# Altium project OpenHEGV3.PrjPcb
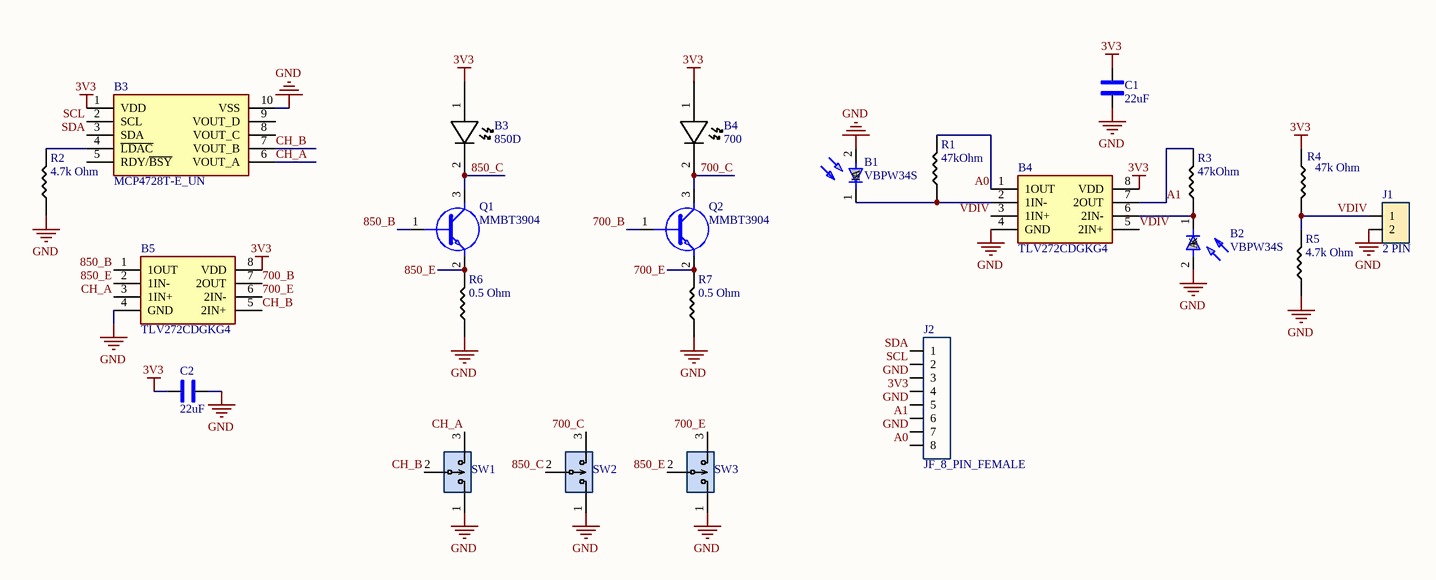
[diagram p0: OpenHEG.SchDoc]
1 sheet, 23 parts. Net scope: global (net labels, ports and power ports of the same name join across sheets).
Board file: OpenHEG.PcbDoc

## Sheet OpenHEG.SchDoc
size A3; SheetNumber: 1; SheetTotal: 1

### Parts
(Parts that share a designator on the sheet are numbered #1, #2 ... from top to bottom, then left to right.)
B1  VBPW34S  [VBPW34S]
B2  VBPW34S  [VBPW34S]
B3#1  MCP4728T-E_UN  [SOP50P490X110-10N]
B3#2  850D  [PCBComponent_1]
B4#1  700  [PCBComponent_1]
B4#2  TLV272CDGKG4  [SOP65P490X110-8N]
B5  TLV272CDGKG4  [SOP65P490X110-8N]
C1  22uF  [1206_Passive_Capacitor]
C2  22uF  [1206_Passive_Capacitor]
J1  2 PIN  [2_PIN_100MIL]
J2  JF_8_PIN_FEMALE  [8_PIN_100MIL - Female]
Q1  MMBT3904  [SOT95P240X120-3N]
Q2  MMBT3904  [SOT95P240X120-3N]
R1  value 47kOhm  [0603_PASSIVE_Resistor]  (hidden comment: 47k Ohm)
R2  4.7k Ohm  [0603_PASSIVE_Resistor]
R3  value 47kOhm  [0603_PASSIVE_Resistor]  (hidden comment: 47k Ohm)
R4  value 47k Ohm  [0603_PASSIVE_Resistor]  (hidden comment: 47kOhm)
R5  4.7k Ohm  [0603_PASSIVE_Resistor]
R6  0.5 Ohm  [0603_PASSIVE_Resistor]
R7  0.5 Ohm  [0603_PASSIVE_Resistor]
SW1  PREC003SAAN-RC  [3_PIN_100mil]  (value not drawn)
SW2  PREC003SAAN-RC  [3_PIN_100mil]  (value not drawn)
SW3  PREC003SAAN-RC  [3_PIN_100mil]  (value not drawn)

### Nets
3V3: B3#1.1(VDD) B3#2.1 B4#1.1 B4#2.8(VDD) B5.8(VDD) C1.1 C2.2 J2.4 R4.1
GND: B1.2(A) B2.2(A) B3#1.10(VSS) B4#2.4(GND) B5.4(GND) C1.2 C2.1 J1.2 J2.3 J2.5 J2.7 R2.1 R5.1 R6.1 R7.1 SW1.1 SW2.1 SW3.1
700_B: B5.7(2OUT) Q2.1(B)
700_C: B4#1.2 Q2.3(C) SW2.3
700_E: B5.6(2IN-) Q2.2(E) R7.2 SW3.3
850_B: B5.1(1OUT) Q1.1(B)
850_C: B3#2.2 Q1.3(C) SW2.2
850_E: B5.2(1IN-) Q1.2(E) R6.2 SW3.2
A0: B4#2.1(1OUT) J2.8 R1.2
A1: B4#2.7(2OUT) J2.6 R3.2
CH_A: B3#1.6(VOUT_A) B5.3(1IN+) SW1.3
CH_B: B3#1.7(VOUT_B) B5.5(2IN+) SW1.2
SCL: B3#1.2(SCL) J2.2
SDA: B3#1.3(SDA) J2.1
VDIV: B4#2.3(1IN+) B4#2.5(2IN+) J1.1 R4.2 R5.2
NetB1_1: B1.1(K) B4#2.2(1IN-) R1.1
NetB2_1: B2.1(K) B4#2.6(2IN-) R3.1
NetB3#1_4: B3#1.4(~{LDAC}) R2.2

Not connected (* = marked no-connect by the designer): B3#1 5(RDY/~{BSY}) 8(VOUT_C) 9(VOUT_D)

### Library data of the parts
B1 B2 = CMP-006-000002-2: Photodiode PIN Chip 940nm 2-Pin SMD T/R; Manufacturer_Name: Vishay; Geometry.Height: 1.4mm; Mouser Price/Stock: https://www.mouser.co.uk/ProductDetail/Vishay-Semiconductors/VBPW34S?qs=Uj7aA%252BCqp8ZDwjFKEZ8K8A%3D%3D; Source: VBPW34S.SchLib; Mouser Part Number: 782-VBPW34S; Arrow Part Number: VBPW34S; Manufacturer_Part_Number: VBPW34S; Design Item ID: VBPW34S; Datasheet Link: https://componentsearchengine.com/Datasheets/2/VBPW34S.pdf; Arrow Price/Stock: https://www.arrow.com/en/products/vbpw34s/vishay?utm_currency=USD&region=nac
B3#1 = CMP-009-000002-1: Digital to Analog Converters - DAC Quad 12-bit NV DAC with I2C interface; Manufacturer_Name: Microchip; Manufacturer_Part_Number: MCP4728T-E/UN; Geometry.Height: 1.1mm; Mouser Price/Stock: https://www.mouser.co.uk/ProductDetail/Microchip-Technology/MCP4728T-E-UN?qs=E6wAi2XWqcPJxULNRq0fKQ%3D%3D; Mouser Part Number: 579-MCP4728T-E/UN; Arrow Part Number: MCP4728T-E/UN; Arrow Price/Stock: https://www.arrow.com/en/products/mcp4728t-eun/microchip-technology?utm_currency=USD&region=nac; Design Item ID: MCP4728T-E_UN; Datasheet Link: https://componentsearchengine.com/Datasheets/2/MCP4728T-E_UN.pdf; Source: MCP4728T-E_UN.SchLib
B3#2 B4#1 = CMP-022-000000-1: Design Item ID: 805D; Source: SMT850.SchLib
B4#2 B5 = CMP-003-000001-2: Operational Amplifiers - Op Amps 550-uA/Ch 3-MHz Rail-to-Rail Out; Manufacturer_Name: Texas Instruments; Geometry.Height: 1.1mm; Mouser Part Number: 595-TLV272CDGKG4; Manufacturer_Part_Number: TLV272CDGKG4; Source: TLV272CDGKG4.SchLib; Arrow Part Number: *; Design Item ID: TLV272CDGKG4; Mouser Price/Stock: https://www.mouser.com/Search/Refine.aspx?Keyword=595-TLV272CDGKG4; Arrow Price/Stock: *; Datasheet Link: https://www.ti.com/lit/ds/symlink/tlv272.pdf?ts=1621864530946&ref_url=https%253A%252F%252Fwww.ti.com%252Fproduct%252FTLV272
C1 C2 = C_22uF_1206: 22uF ±10% 25V X5R 1206 Multilayer Ceramic Capacitors MLCC - SMD/SMT RoHS; MFR Part #: CL31A226KAHNNNE; Type: basic; LCSC Part#: C12891; Datasheet: https://datasheet.lcsc.com/lcsc/1811031514_Samsung-Electro-Mechanics-CL31A226KAHNNNE_C12891.pdf; Value: 22uF
J1 = JM_2_PIN_MALE: 2.54mm Straight 2 1 Header，Breakaway Through Hole,P=2.54mm Pin Header & Female Header ROHS; MFR Part #: B-2100S02P-A110; Type: Extended; Datasheet: https://datasheet.lcsc.com/lcsc/1811151421_Ckmtw-Shenzhen-Cankemeng-B-2100S02P-A110_C124375.pdf; LCSC Part#: C124375; Value: 2 PIN
J2 = CMP-005-000002-1: 8 Position Header Connector 0.100" (2.54mm) Through Hole Tin; MFR Part #: PPTC081LFBN-RC; Source: iotaCore.SCHLIB; LCSC Part#: C27438; Type: Extended; Pin Count: 8; Component Type: Standard; Digikey Link: https://www.digikey.com/product-detail/en/PPTC081LFBN-RC/S7006-ND/810147/?itemSeq=304982354; Design Item ID: JF_8_PIN_FEMALE
Q1 Q2 = CMP-017-000000-1: SOT-23-3; Manufacturer_Name: onsemi; Geometry.Height: 1.2mm; Source: MMBT3904.SchLib; Arrow Part Number: MMBT3904; Manufacturer_Part_Number: MMBT3904; Mouser Part Number: 512-MMBT3904; Arrow Price/Stock: https://www.arrow.com/en/products/mmbt3904/on-semiconductor; Datasheet Link: https://www.onsemi.com/download/data-sheet/pdf/PZT3904-D.pdf; Mouser Price/Stock: https://www.mouser.co.uk/ProductDetail/onsemi-Fairchild/MMBT3904?qs=UMEuL5FsraCg3xKjS4uBJQ%3D%3D; Design Item ID: MMBT3904
R1 R3 R4 = R_2Ohm_0603: CHIP RESISTOR - SURFACE MOUNT 47kOHMS ±1% 1/10W 0603 ROHS; MFR Part #: 0603WAF200KT5E; Datasheet: https://datasheet.lcsc.com/szlcsc/Uniroyal-Elec-0603WAF200KT5E_C22977.pdf; LCSC Part#: C22977; Type: Basic
R2 R5 = R_2Ohm_0603: CHIP RESISTOR - SURFACE MOUNT 4.7kOHMS ±1% 1/10W 0603 ROHS; MFR Part #: 0603WAF200KT5E; Datasheet: https://datasheet.lcsc.com/szlcsc/Uniroyal-Elec-0603WAF200KT5E_C22977.pdf; LCSC Part#: C22977; Type: Basic; Value: 4.7k Ohm
R6 R7 = R_2Ohm_0603: CHIP RESISTOR - SURFACE MOUNT 0.5OHMS ±1% 1/10W 0603 ROHS; MFR Part #: 0603WAF200KT5E; Datasheet: https://datasheet.lcsc.com/szlcsc/Uniroyal-Elec-0603WAF200KT5E_C22977.pdf; LCSC Part#: C22977; Type: Basic; Value: 0.5 Ohm
SW1-SW3 = SW_3Pin_100mil_Switch: Connector Header Through Hole 3 position 0.100" (2.54mm); Value: CONN HEADER VERT 3POS 2.54MM; Digikey Link: https://www.digikey.com/product-detail/en/PREC003SAAN-RC/S1012EC-03-ND/2774851/?itemSeq=304982371; MFR Part #: PREC003SAAN-RC; Type: Extended; LCSC Part#: C49257